# EAGLE design untitled (EAGLE 6.1)
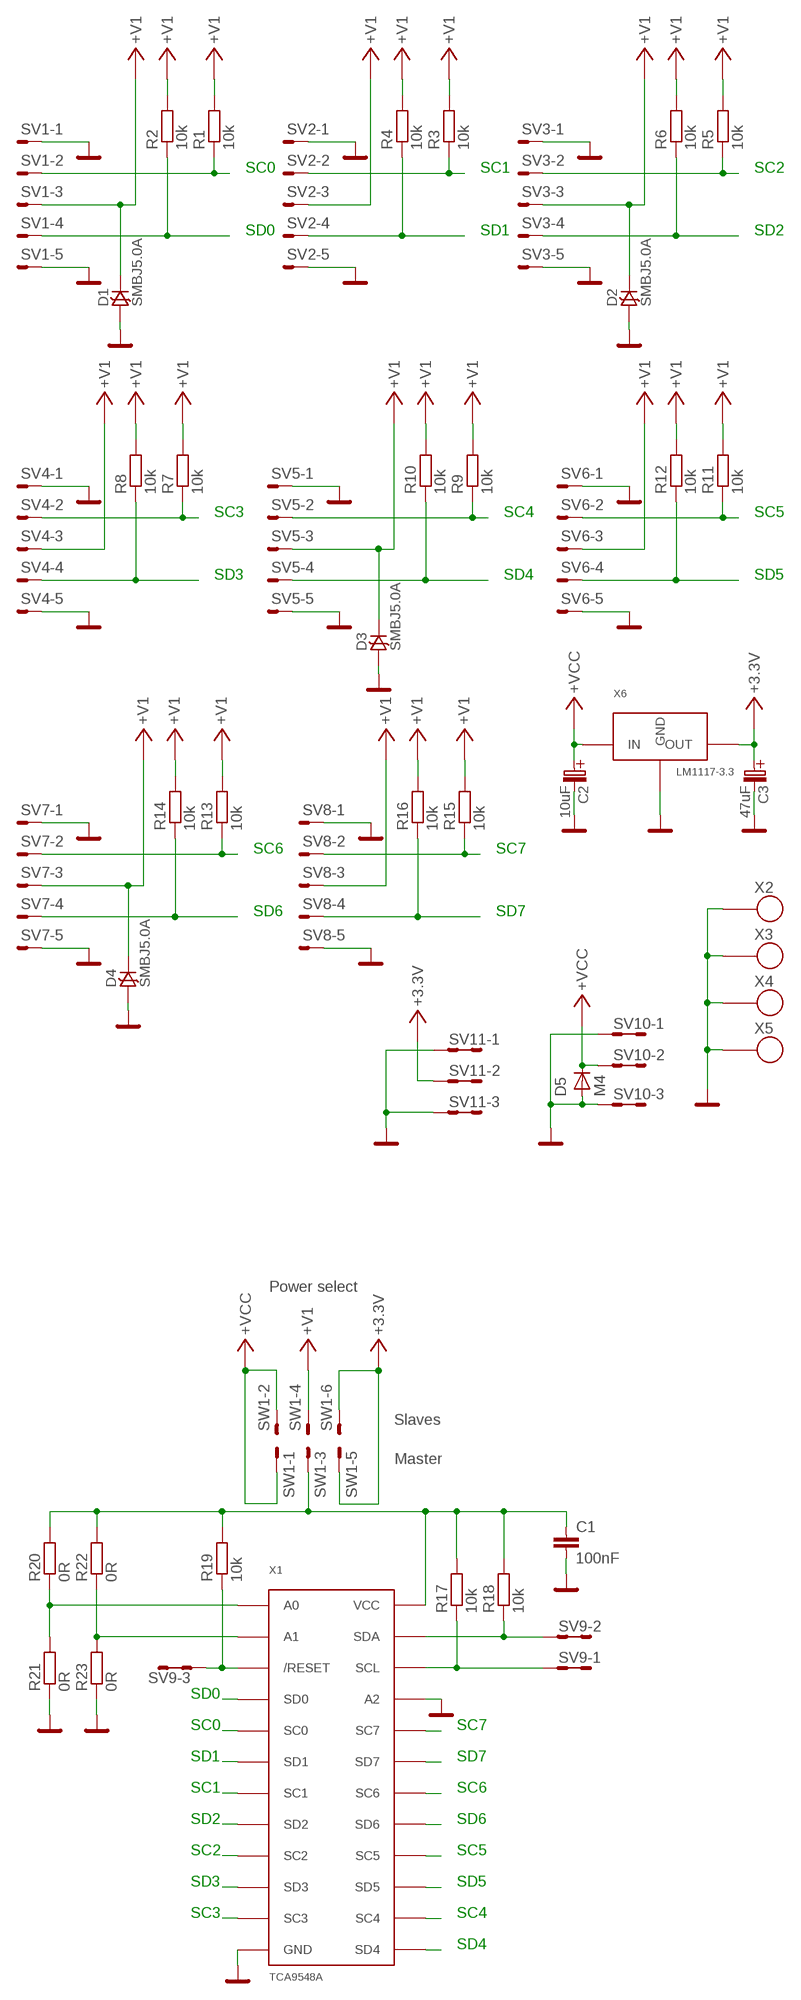
[diagram p0: schematic, sheet 1]

## Parts
C1  100nF  C0805  [C0805]
C2  10uF  B  [B]
C3  47uF  C  [C]
D1  SMBJ5.0A  D-TRANSIL-SMA  [SMA]
D2  SMBJ5.0A  D-TRANSIL-SMA  [SMA]
D3  SMBJ5.0A  D-TRANSIL-SMA  [SMA]
D4  SMBJ5.0A  D-TRANSIL-SMA  [SMA]
D5  M4  D-OB.SMA  [SMA]
R1  10k  R0805  [0805]
R2  10k  R0805  [0805]
R3  10k  R0805  [0805]
R4  10k  R0805  [0805]
R5  10k  R0805  [0805]
R6  10k  R0805  [0805]
R7  10k  R0805  [0805]
R8  10k  R0805  [0805]
R9  10k  R0805  [0805]
R10  10k  R0805  [0805]
R11  10k  R0805  [0805]
R12  10k  R0805  [0805]
R13  10k  R0805  [0805]
R14  10k  R0805  [0805]
R15  10k  R0805  [0805]
R16  10k  R0805  [0805]
R17  10k  R0805  [0805]
R18  10k  R0805  [0805]
R19  10k  R0805  [0805]
R20  0R  R0805  [0805]
R21  0R  R0805  [0805]
R22  0R  R0805  [0805]
R23  0R  R0805  [0805]
SV1  MA05-1  [MA05-1]
SV2  MA05-1  [MA05-1]
SV3  MA05-1  [MA05-1]
SV4  MA05-1  [MA05-1]
SV5  MA05-1  [MA05-1]
SV6  MA05-1  [MA05-1]
SV7  MA05-1  [MA05-1]
SV8  MA05-1  [MA05-1]
SV9  MA03-2  [MA03-2]
SV10  MA03-2  [MA03-2]
SV11  MA03-2  [MA03-2]
SW1  MA03-3  [MA03-2]
X1  TCA9548A  [TSS0P24]
X2  SROUB3M  [SROUB3M]
X3  SROUB3M  [SROUB3M]
X4  SROUB3M  [SROUB3M]
X5  SROUB3M  [SROUB3M]
X6  LM1117-3.3  LM1117  [SOT223]

## Nets
+3.3V: C3.+(C_EL+) SV11.3 SV11.4 SW1.5 SW1.6 X6.2(OUT) X6.4(OUT)
+V1: D1.K D2.K D3.K D4.K R1.2 R2.2 R3.2 R4.2 R5.2 R6.2 R7.2 R8.2 R9.2 R10.2 R11.2 R12.2 R13.2 R14.2 R15.2 R16.2 SV1.3 SV2.3 SV3.3 SV4.3 SV5.3 SV6.3 SV7.3 SV8.3 SW1.4
+VCC: C2.+(C_EL+) D5.K(C) SV10.3 SV10.4 SW1.1 SW1.2 X6.3(IN)
/RESET: R19.1 SV9.5 SV9.6 X1.3(/RESET)
GND: C1.2 C2.-(C_EL-) C3.-(C_EL-) D1.A D2.A D3.A D4.A D5.A R21.1 R23.1 SV1.1 SV1.5 SV2.1 SV2.5 SV3.1 SV3.5 SV4.1 SV4.5 SV5.1 SV5.5 SV6.1 SV6.5 SV7.1 SV7.5 SV8.1 SV8.5 SV10.1 SV10.2 SV10.5 SV10.6 SV11.1 SV11.2 SV11.5 SV11.6 X1.12(GND) X1.21(A2) X2.P$1 X3.P$1 X4.P$1 X5.P$1 X6.1(GND)
N$5: C1.1 R17.2 R18.2 R19.2 R20.2 R22.2 SW1.3 X1.24(VCC)
N$20: R20.1 R21.2 X1.1(A0)
N$22: R22.1 R23.2 X1.2(A1)
SC0: R1.1 SV1.2 X1.5(SC0)
SC1: R3.1 SV2.2 X1.7(SC1)
SC2: R5.1 SV3.2 X1.9(SC2)
SC3: R7.1 SV4.2 X1.11(SC3)
SC4: R9.1 SV5.2 X1.14(SC4)
SC5: R11.1 SV6.2 X1.16(SC5)
SC6: R13.1 SV7.2 X1.18(SC6)
SC7: R15.1 SV8.2 X1.20(SC7)
SCL: R17.1 SV9.1 SV9.2 X1.22(SCL)
SD0: R2.1 SV1.4 X1.4(SD0)
SD1: R4.1 SV2.4 X1.6(SD1)
SD2: R6.1 SV3.4 X1.8(SD2)
SD3: R8.1 SV4.4 X1.10(SD3)
SD4: R10.1 SV5.4 X1.13(SD4)
SD5: R12.1 SV6.4 X1.15(SD5)
SD6: R14.1 SV7.4 X1.17(SD6)
SD7: R16.1 SV8.4 X1.19(SD7)
SDA: R18.1 SV9.3 SV9.4 X1.23(SDA)

## Notes on the sheet
- SC0 | SC1 | SC2
- SD0 | SD1 | SD2
- SC3 | SC4 | SC5
- SD3 | SD4 | SD5
- SC6 | SC7
- SD6 | SD7
- Power select
- Slaves
- Master
- SD0
- SC0 | SC7
- SD1 | SD7
- SC1 | SC6
- SD2 | SD6
- SC2 | SC5
- SD3 | SD5
- SC3 | SC4
- SD4

## Library data of the parts
C1 = moje_C:C0805
C2 = moje_C:B
C3 = moje_C:C
D1-D4 = moje_diody:D-TRANSIL-SMA
D5 = moje:D-OB.SMA: SMA
R1-R23 = moje_R:R0805
SV1-SV8 = moje_hrebinky:MA05-1: PIN HEADER; OC_FARNELL: unknown; OC_NEWARK: unknown
SV9-SV11 = moje_hrebinky:MA03-2: PIN HEADER; OC_FARNELL: unknown; OC_NEWARK: unknown
SW1 = moje_hrebinky:MA03-3
X1 = moje_io:TCA9548A: I2C HUB TSSOP24
X2-X5 = moje:SROUB3M
X6 = moje_stabil:LM1117: STABILIZATOR LM1117

## Board
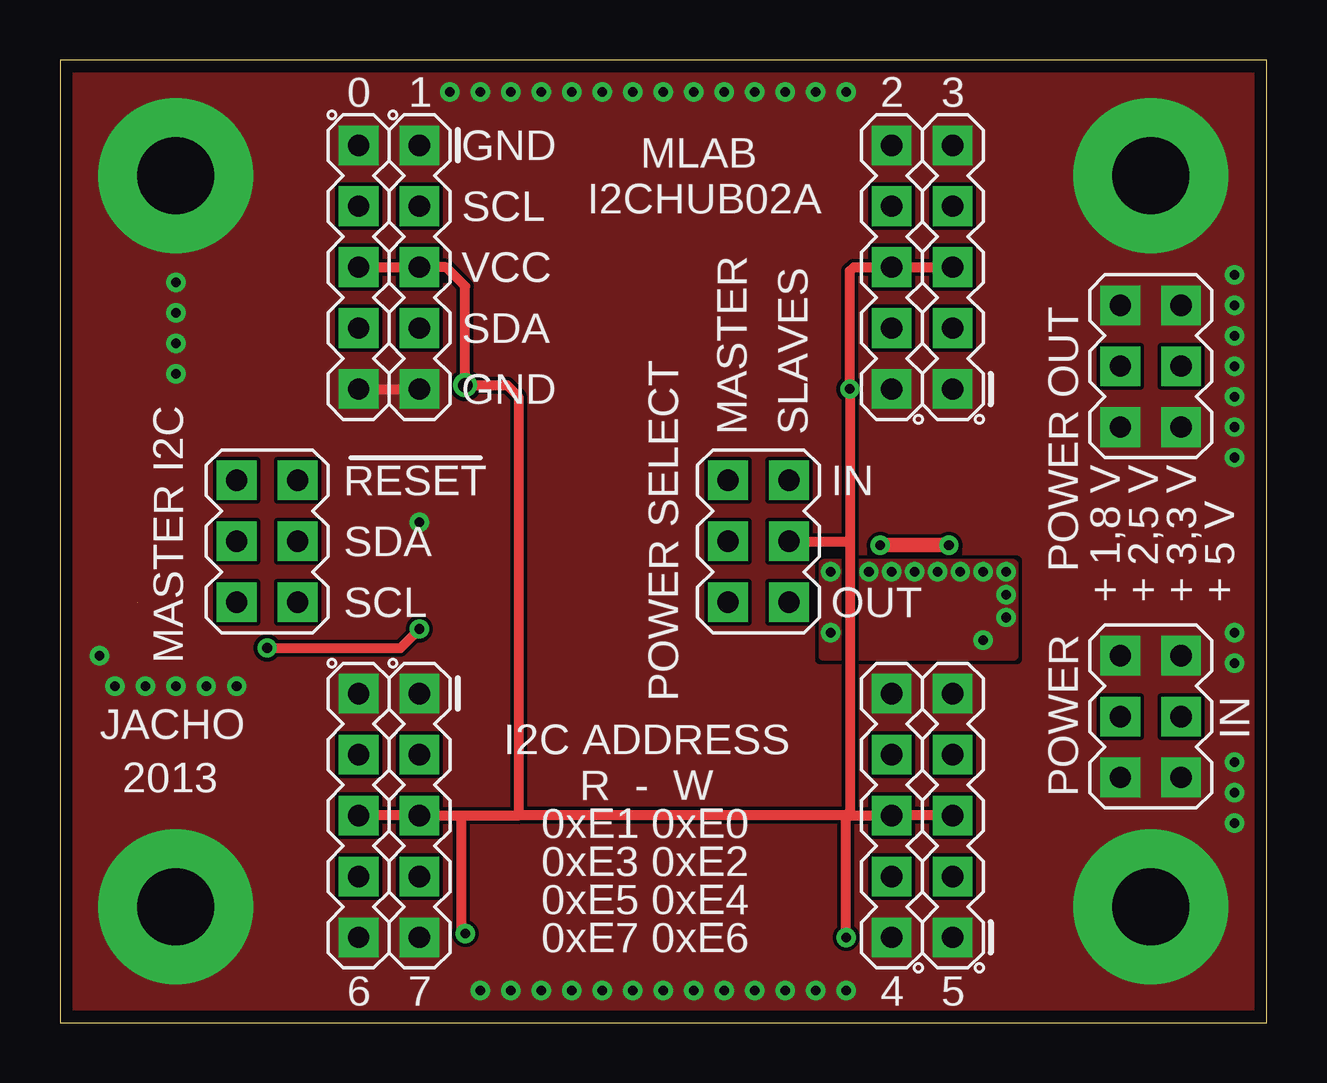
[diagram p1: board, top side]
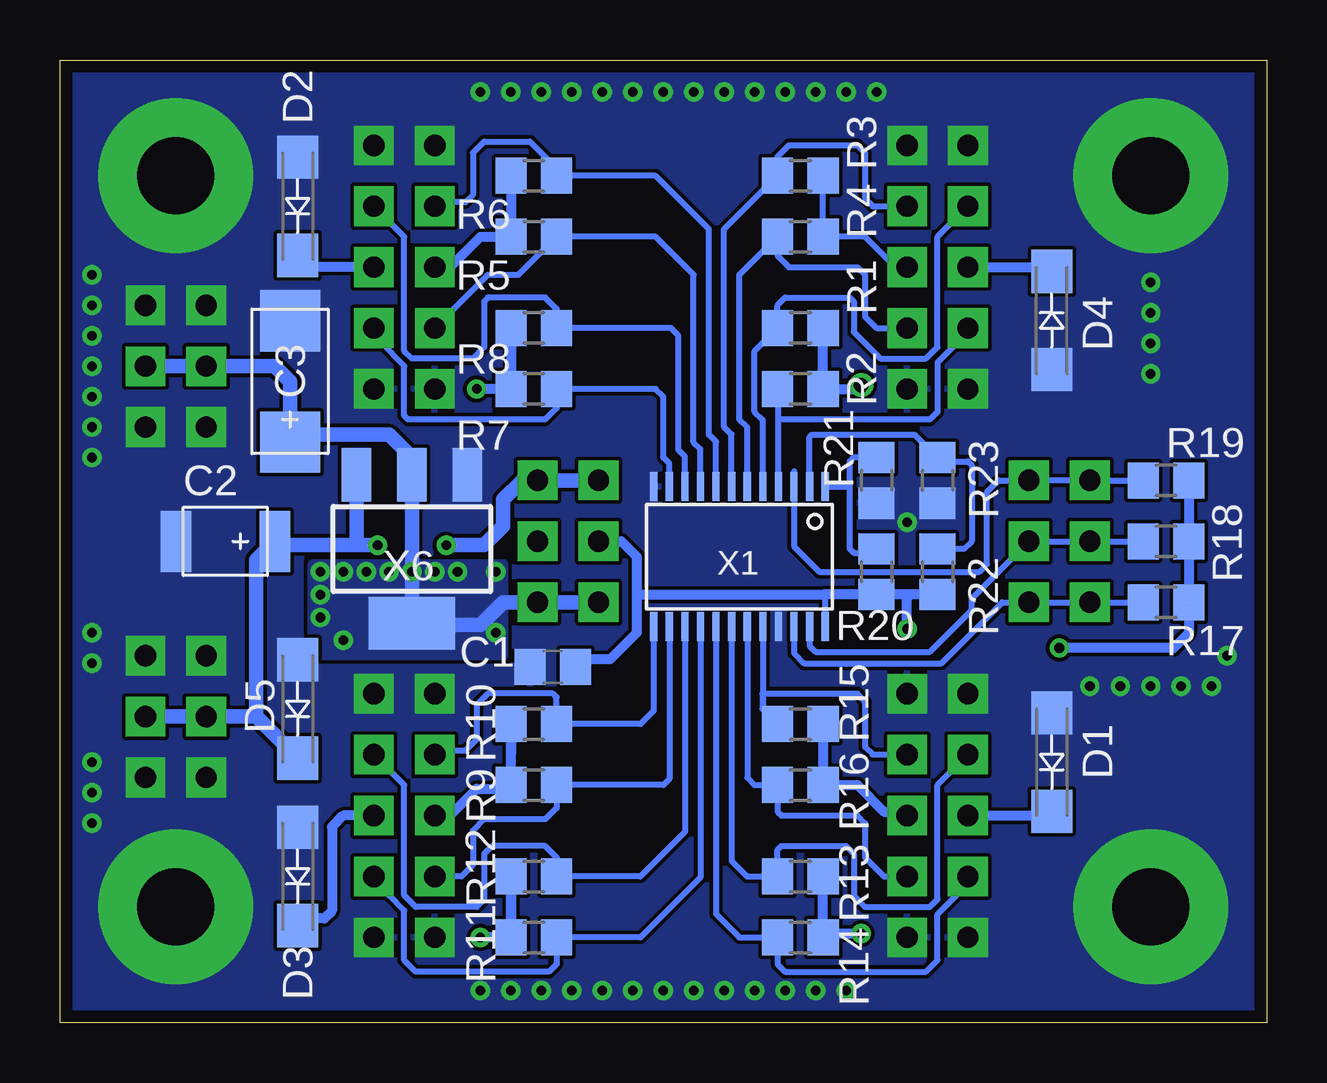
[diagram p2: board, bottom side, seen from below]

Size 50.29 x 40.13 mm. Coordinates in mm from the lower left corner, seen from the top.
Outline: 0,0 50.29,0 50.29,40.13 0,40.13 0,0
Copper layers (1*16): Top 0.035mm / dielectric 1.5mm / Bottom 0.035mm
Design rules: minimum track width 8mil, minimum drill 16mil, track to track 6mil, track to pad 6mil, pad to pad 6mil, via to via 6mil, smd to smd 6mil, copper to edge 20mil, drill to drill 8mil, minimum pad ring 10mil, minimum via ring 8mil, stop-mask expansion 4mil, vias tented up to drill 25mil, thermal gap 0mil

### Footprints (pad centres in the part's own frame; a part is rotated, then mirrored left to right if it is on the bottom)
C0805 = smd 1.3 x 1.5: 1 -0.95,0; 2 0.95,0
B = smd 1.27 x 2.54: + 2.223,0; - -1.905,0
C = smd 2.55 x 2.5: + 2.525,0; - -2.525,0
SMA = smd 1.8 x 1.7: A -2.05,0; K 2.05,0
0805 = smd 1.3 x 1.5: 1 -0.95,0; 2 0.95,0
MA05-1 = drill 0.889 pad 1.651 square: 1 -5.08,0; 2 -2.54,0; 3 0,0; 4 2.54,0; 5 5.08,0
MA03-2 = drill 0.889 pad 1.651 square: 1 -2.54,-1.27; 2 -2.54,1.27; 3 0,-1.27; 4 0,1.27; 5 2.54,-1.27; 6 2.54,1.27
TSS0P24 = smd 0.3 x 1.2: 1 -3.575,-2.918; 2 -2.925,-2.918; 3 -2.275,-2.918; 4 -1.625,-2.918; 5 -0.975,-2.918; 6 -0.325,-2.918; 7 0.325,-2.918; 8 0.975,-2.918; 9 1.625,-2.918; 10 2.275,-2.918; 11 2.925,-2.918; 12 3.575,-2.918; 13 3.575,2.918; 14 2.925,2.918; 15 2.275,2.918; 16 1.625,2.918; 17 0.975,2.918; 18 0.325,2.918; 19 -0.325,2.918; 20 -0.975,2.918; 21 -1.625,2.918; 22 -2.275,2.918; 23 -2.925,2.918; 24 -3.575,2.918
SROUB3M = drill 3.2 pad 6.452: P$1 0,0
SOT223 = smd 1.219 x 2.235: 1 -2.311,-3.099; 2 0,-3.099; 3 2.311,-3.099 | smd 3.6 x 2.2: 4 0,3.099

### Placement (x,y rotation side)
C1  29.75,14.83 180 bottom
C2  43.56,20.07 0 bottom
C3  40.7,26.73 270 bottom
D1  8.95,10.86 270 bottom
D2  40.39,34.04 270 bottom
D3  40.39,6.1 270 bottom
D4  8.95,29.27 90 bottom
D5  40.39,13.08 270 bottom
R1  19.43,28.96 0 bottom
R2  19.43,26.42 0 bottom
R3  19.43,35.31 0 bottom
R4  19.43,32.77 0 bottom
R5  30.54,32.77 180 bottom
R6  30.54,35.31 180 bottom
R7  30.54,26.42 180 bottom
R8  30.54,28.96 180 bottom
R9  30.54,9.91 180 bottom
R10  30.54,12.45 180 bottom
R11  30.54,3.56 180 bottom
R12  30.54,6.1 180 bottom
R13  19.43,6.1 0 bottom
R14  19.43,3.56 0 bottom
R15  19.43,12.45 0 bottom
R16  19.43,9.91 0 bottom
R17  4.19,17.53 0 bottom
R18  4.19,20.07 0 bottom
R19  4.19,22.61 0 bottom
R20  16.26,18.8 270 bottom
R21  16.26,22.61 90 bottom
R22  13.72,18.8 270 bottom
R23  13.72,22.61 90 bottom
SV1  12.45,31.5 270 top
SV2  14.99,31.5 270 top
SV3  34.67,31.5 90 top
SV4  37.21,31.5 90 top
SV5  34.67,8.64 90 top
SV6  37.21,8.64 90 top
SV7  12.45,8.64 270 top
SV8  14.99,8.64 270 top
SV9  8.64,20.07 90 top
SV10  45.47,12.76 270 top
SV11  45.47,27.37 270 top
SW1  29.11,20.07 270 top
X1  21.97,19.43 180 bottom
X2  4.83,4.83 0 top
X3  4.83,35.31 0 top
X4  45.47,4.83 0 top
X5  45.47,35.31 0 top
X6  35.62,19.75 180 bottom

### Tracks (layer width: path | path; a pad name or v marks a point on that pad's centre or on a via)
+3.3V  (via drill 0.4)
  Bottom 0.61: SW1.5 SW1.6 31.81,17.53 32.77,16.57 35.55,16.57 X6.4 X6.2 35.62,23.56 36.58,24.51 40.7,24.51 | SV11.4 SV11.3 41.34,27.37 40.7,26.73 40.7,24.51 | 40.7,24.51 40.7,24.35 C3.+ 40.7,24.19
  other vias: 38.48,15.94 39.43,16.89 39.43,17.84 39.43,18.8 38.48,18.8 37.53,18.8 36.58,18.8 35.62,18.8 34.67,18.8 33.72,18.8 32.13,18.8 32.13,16.26
  pour Bottom: 31.81,19.11 31.81,15.3 39.75,15.3 39.75,19.11
  pour Top: 31.81,19.11 31.81,15.3 39.75,15.3 39.75,19.11
+V1  (via drill 0.4, 0.6)
  Top 0.406: SV1.3 SV2.3 16.1,31.5 16.89,30.7 v16.89,26.57 18.64,26.57 19.11,26.1 19.11,8.64 | v16.89,3.71 16.73,3.87 16.73,8.64 | SV7.3 SV8.3 16.73,8.64 | 37.37,8.64 SV6.3 SV5.3 32.77,8.64 | v32.77,3.56 32.77,8.64 | 32.77,8.64 19.11,8.64 | 16.73,8.64 19.11,8.64 | SV4.3 SV3.3 33.08,31.5 32.93,31.34 v32.93,26.42 32.93,20.07 | SW1.4 32.93,20.07 | 32.93,20.07 32.93,8.79 32.77,8.64
  Bottom 0.254: 18.64,35.15 18.48,34.99 R4.2 16.73,32.77 15.46,31.5 SV2.3
  Bottom 0.406: R1.2 R2.2 17.05,26.42 v16.89,26.57 | R15.2 R16.2 17.05,9.91 15.94,8.79 15.14,8.79 SV8.3 | R13.2 R14.2 18.32,3.71 v16.89,3.71 | SV5.3 34.04,8.64 32.93,9.75 31.65,9.75 R9.2 R10.2 31.49,11.18 31.5,11.18 | SV6.3 38.48,8.64 38.96,8.16 38.96,4.67 39.28,4.35 40.08,4.35 D3.K | R11.2 R12.2 R11.2 v32.77,3.56 | 18.64,35.15 R3.2 | R6.2 R5.2 32.77,32.77 34.04,31.5 SV3.3 | SV4.3 39.9,31.5 D2.K | R8.2 R7.2 v32.93,26.42 | SV1.3 9.27,31.5 D4.K 9.27,31.18 | SV7.3 9.27,8.64 9.11,8.79 9.1,8.81 | 9.1,8.81 8.95,8.95 | D1.K 9.1,8.81
+VCC  (via drill 0.4)
  Top 0.61: v34.2,19.91 v37.05,19.91
  Bottom 0.61: X6.3 37.94,19.98 38.01,19.91 | SW1.1 SW1.2 30.86,22.61 31.02,22.61 31.81,21.81 31.81,20.7 32.61,19.91 v34.2,19.91 | v37.05,19.91 38.01,19.91 | 38.01,19.91 41.18,19.91 C2.+ 42.12,19.29 42.12,12.76 | SV10.4 SV10.3 42.12,12.76 | 42.12,12.76 D5.K
/RESET
  Bottom 0.254: 19.7,22.98 X1.3 19.7,19.86 18.64,18.8 11.97,18.8 11.65,19.11 11.65,22.13 11.18,22.61 SV9.5 SV9.6 R19.1
GND  (via drill 0.4)
  Top 0.406: SV1.5 SV2.5
  other vias: 14.99,20.86 6.1,14.03 4.83,30.86 4.83,29.59 4.83,28.32 4.83,27.05 4.83,14.03 3.56,14.03 2.29,14.03 7.37,14.03 1.65,15.3 21.34,1.33 22.61,1.33 23.88,1.33 25.15,1.33 26.42,1.33 27.69,1.33 48.96,10.86 48.96,9.59 48.96,8.32 48.96,14.99 48.96,16.26 48.96,23.56 48.96,24.83 48.96,26.1 48.96,27.37 48.96,28.64 48.96,29.91 48.96,31.18 25.15,38.8 26.42,38.8 27.69,38.8 28.96,38.8 30.23,38.8 31.5,38.8 32.77,38.8 23.88,38.8 22.61,38.8 21.34,38.8 20.07,38.8 18.8,38.8 17.53,38.8 16.26,38.8 28.96,1.33 30.23,1.33 31.5,1.33 32.77,1.33 20.07,1.33 18.8,1.33 17.53,1.33
  pour Bottom (rank 2): 0.06,40.07 0.06,-0.25 50.23,-0.25 50.23,40.23 -0.1,40.23 -0.1,39.91
  pour Top (rank 2): 0.22,39.91 50.55,39.91 50.55,-1.37 0.06,-1.37 0.06,39.91
N$5  (via drill 0.4)  (1 unrouted)
  Top 0.406: v8.64,15.62 14.19,15.62 v14.99,16.41
  Bottom 0.254: X1.24 18.4,17.76 18.48,17.85
  Bottom 0.406: R19.2 R18.2 3.24,19.91 R17.2 | R17.2 3.24,16.25 3.87,15.62 v8.64,15.62 | R22.2 14.83,17.85 | 14.83,17.85 R20.2 18.48,17.85 18.48,17.84 26.26,17.84 | C1.1 28.8,14.98 28.64,15.14 27.37,15.14 26.26,16.26 26.26,17.84 | v14.99,16.41 14.99,17.69 14.83,17.85 | SW1.3 26.89,20.07 26.26,19.43 26.26,17.84
N$20
  Bottom 0.254: R21.2 17.21,23.56 17.37,23.4 17.37,22.29 | R20.1 16.41,19.59 17.21,19.59 17.37,19.75 17.37,22.29 | X1.1 17.43,22.35 17.37,22.29
N$22
  Bottom 0.254: X1.2 19.05,24.42 18.95,24.51 14.67,24.51 R23.2 13.72,23.4 12.45,23.4 12.29,23.24 12.29,20.07 12.61,19.75 13.56,19.75 | 13.56,19.75 13.88,19.75 | R22.1 13.56,19.75
SC0
  Bottom 0.254: SV1.2 13.72,32.77 13.72,28.16 14.19,27.69 16.1,27.69 17.21,28.8 17.21,30.07 17.37,30.23 20.07,30.23 20.38,29.91 R1.1 21.34,28 21.34,25.46 21,25.12 X1.5
SC1
  Bottom 0.254: SV2.2 16.41,34.04 16.73,34.35 16.73,36.26 17.05,36.58 19.91,36.58 20.38,36.1 R3.1 22.61,33.08 22.61,24.83 22.3,24.52 X1.7
SC2
  Bottom 0.254: X1.9 23.6,23.91 23.88,24.19 23.88,31.18 25.46,32.77 R5.1 31.18,31.18 32.45,31.18 SV3.2
SC3
  Bottom 0.254: SV4.2 36.89,28.64 36.89,28.32 35.94,27.37 35.94,25.3 35.78,25.15 30.07,25.15 29.59,25.62 R7.1 25.46,26.42 25.15,26.1 25.15,23.56 24.9,23.31 X1.11
SC4
  Bottom 0.254: R9.1 29.59,8.95 30.07,8.48 32.61,8.48 33.08,8 33.08,6.57 33.56,6.1 SV5.2 | X1.14 24.9,10.16 25.15,9.91 R9.1
  Bottom 0.406: R9.1
SC5
  Bottom 0.254: SV6.2 36.58,5.46 36.58,5.3 35.94,4.67 35.94,2.6 35.47,2.13 29.91,2.13 29.59,2.44 R11.1 26.1,3.56 23.6,6.06 X1.16
SC6
  Bottom 0.254: SV7.2 13.72,9.91 13.72,5.14 14.03,4.83 16.73,4.83 17.21,5.3 17.21,7.05 17.53,7.37 20.22,7.37 20.38,7.21 R13.1 21.65,6.1 22.3,6.74 X1.18
SC7
  Bottom 0.254: 14.83,11.18 SV8.2 16.41,11.18 16.73,11.49 16.73,13.4 17.05,13.72 21.02,13.72 21.02,13.08 21,13.06 | X1.20 21,13.06 | 21,13.06 20.86,12.92 R15.1
SCL
  Bottom 0.254: R17.1 SV9.2 SV9.1 11.02,17.53 13.56,14.99 19.27,14.99 19.7,15.41 X1.22
SD0
  Bottom 0.254: SV1.4 12.45,28.8 13.72,27.53 13.72,25.46 14.03,25.15 20.35,25.15 | X1.4 20.35,25.15 | 20.35,25.15 20.35,26.38 R2.1
SD1
  Bottom 0.254: SV2.4 16.26,28.96 16.73,29.43 16.73,31.18 17.05,31.5 19.91,31.5 20.38,31.97 R4.1 21.97,31.18 21.97,25.15 21.65,24.82 X1.6
SD2
  Bottom 0.254: SV3.4 34.51,34.2 33.4,34.2 33.08,34.51 33.08,36.26 32.61,36.73 30.7,36.73 29.59,35.62 R6.1 25.46,35.31 23.24,33.08 23.24,24.51 22.95,24.22 X1.8
SD3
  Bottom 0.254: SV4.4 35.94,32.77 35.94,28 35.62,27.69 33.08,27.69 32.61,28.16 32.61,30.07 32.45,30.23 30.07,30.23 29.59,29.75 R8.1 24.83,28.96 24.51,28.64 24.51,23.88 24.25,23.61 X1.10
SD4
  Bottom 0.254: SV5.4 34.51,11.34 33.4,11.34 32.93,11.81 32.93,13.24 32.45,13.72 29.75,13.72 29.59,13.56 R10.1 26.1,12.45 25.55,13 X1.13
SD5
  Bottom 0.254: SV6.4 35.94,9.91 35.94,5.3 35.47,4.83 32.93,4.83 32.61,5.14 32.61,7.05 32.29,7.37 30.07,7.37 29.59,6.89 R12.1 26.1,6.1 24.25,7.95 X1.15
SD6
  Bottom 0.254: SV7.4 12.61,5.94 12.61,5.62 13.72,4.51 13.72,2.6 14.19,2.13 20.07,2.13 20.38,2.44 R14.1 21.97,3.56 22.95,4.53 X1.17
SD7
  Bottom 0.254: SV8.4 15.94,6.1 16.73,6.89 16.73,8.32 17.05,8.64 20.22,8.64 20.38,8.79 R16.1 21.34,9.91 21.65,10.22 X1.19
SDA
  Bottom 0.254: R18.1 SV9.4 SV9.3 12.29,17.68 12.29,17.21 14.03,15.46 18.8,15.46 19.05,15.71 X1.23

### Text on the board
tPlace: 0 | 1 | 2 | 3 | GND | MLAB | SCL | I2CHUB02A | VCC | SDA | GND | MASTER | SLAVES | RESET | IN | SDA | POWER OUT | + 1,8 V | + 2,5 V | + 3,3 V | + 5 V | SCL | OUT | MASTER I2C | POWER SELECT | JACHO | IN | I2C ADDRESS | 2013 | R - W | POWER | 0xE1 0xE0 | 0xE3 0xE2 | 0xE5 0xE4 | 0xE7 0xE6 | 6 | 7 | 4 | 5